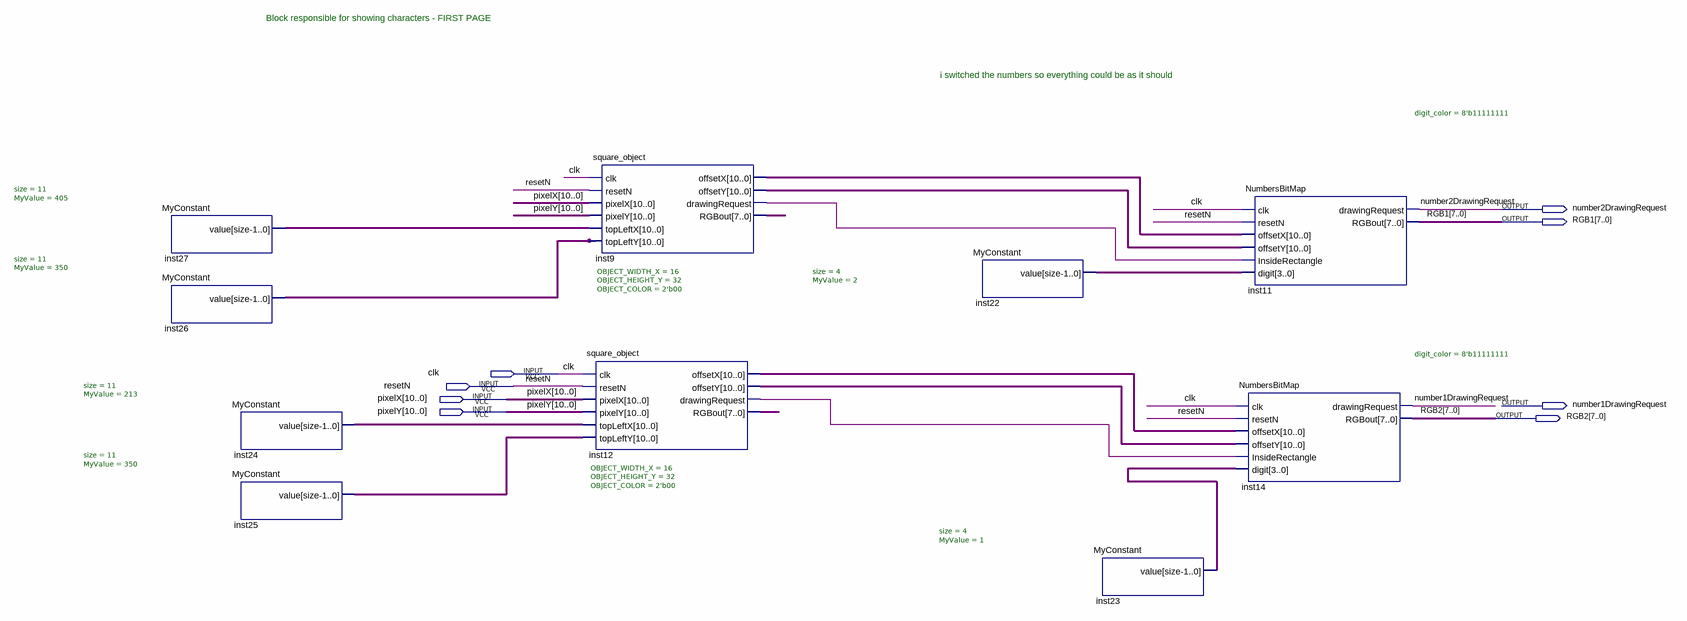
[diagram p0: schematic sheet]
// Quartus schematic ShowNUM_Firstpage.bdf as structural Verilog: 10 symbols, 8 pins
module ShowNUM_Firstpage (
  input  clk,
  input  resetN,
  input  [10:0] pixelX,
  input  [10:0] pixelY,
  output number2DrawingRequest,
  output [7:0] RGB1,
  output number1DrawingRequest,
  output [7:0] RGB2
);

  wire inst9_drawingrequest, inst12_drawingrequest;
  wire [3:0] inst22_value, inst23_value;
  wire [7:0] inst9_rgbout, inst12_rgbout;
  wire [10:0] inst9_offsetx, inst9_offsety, inst12_offsetx, inst12_offsety, inst24_value, inst25_value,
       inst26_value, inst27_value;

  MyConstant #(.size(11), .MyValue(405)) inst27 (.value(inst27_value));
  MyConstant #(.size(11), .MyValue(350)) inst26 (.value(inst26_value));
  MyConstant #(.size(11), .MyValue(213)) inst24 (.value(inst24_value));
  MyConstant #(.size(11), .MyValue(350)) inst25 (.value(inst25_value));
  square_object #(.OBJECT_WIDTH_X(16), .OBJECT_HEIGHT_Y(32), .OBJECT_COLOR(2'b00)) inst9 (
    .clk(clk), .resetN(resetN), .pixelX(pixelX), .pixelY(pixelY), .topLeftX(inst27_value),
    .topLeftY(inst26_value), .offsetX(inst9_offsetx), .offsetY(inst9_offsety),
    .drawingRequest(inst9_drawingrequest), .RGBout(inst9_rgbout));
  square_object #(.OBJECT_WIDTH_X(16), .OBJECT_HEIGHT_Y(32), .OBJECT_COLOR(2'b00)) inst12 (
    .clk(clk), .resetN(resetN), .pixelX(pixelX), .pixelY(pixelY), .topLeftX(inst24_value),
    .topLeftY(inst25_value), .offsetX(inst12_offsetx), .offsetY(inst12_offsety),
    .drawingRequest(inst12_drawingrequest), .RGBout(inst12_rgbout));
  MyConstant #(.size(4), .MyValue(2)) inst22 (.value(inst22_value));
  MyConstant #(.size(4), .MyValue(1)) inst23 (.value(inst23_value));
  NumbersBitMap #(.digit_color(8'b11111111)) inst11 (
    .clk(clk), .resetN(resetN), .offsetX(inst9_offsetx), .offsetY(inst9_offsety),
    .InsideRectangle(inst9_drawingrequest), .digit(inst22_value), .drawingRequest(number2DrawingRequest),
    .RGBout(RGB1));
  NumbersBitMap #(.digit_color(8'b11111111)) inst14 (
    .clk(clk), .resetN(resetN), .offsetX(inst12_offsetx), .offsetY(inst12_offsety),
    .InsideRectangle(inst12_drawingrequest), .digit(inst23_value), .drawingRequest(number1DrawingRequest),
    .RGBout(RGB2));

  // Notes on the sheet:
  //   Block responsible for showing characters - FIRST PAGE
  //    i switched the numbers so everything could be as it should
endmodule
